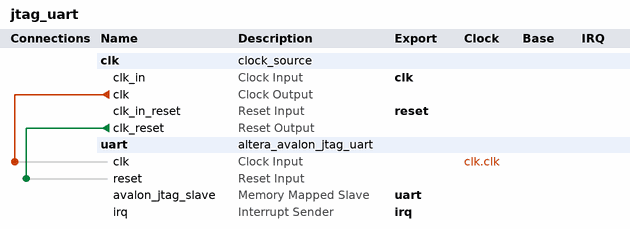
[diagram p0: system contents]
# Platform Designer (Qsys) system jtag_uart, MAX 10 10M50DAF484C7G
# Parameters at their usual value, and those the tool derives, are not listed.
package require -exact qsys 18.1
create_system jtag_uart
set_project_property DEVICE_FAMILY {MAX 10}
set_project_property DEVICE 10M50DAF484C7G

add_instance clk clock_source 18.1
set_instance_parameter_value clk clockFrequency 50000000

add_instance uart altera_avalon_jtag_uart 18.1
set_instance_parameter_value uart simInteractiveOptions NO_INTERACTIVE_WINDOWS

# connections
add_connection clk.clk uart.clk clock
add_connection clk.clk_reset uart.reset reset

# exported interfaces
add_interface clk clock sink
set_interface_property clk EXPORT_OF clk.clk_in
add_interface irq interrupt sender
set_interface_property irq EXPORT_OF uart.irq
add_interface reset reset sink
set_interface_property reset EXPORT_OF clk.clk_in_reset
add_interface uart avalon slave
set_interface_property uart EXPORT_OF uart.avalon_jtag_slave

set_interconnect_requirement {$system} qsys_mm.clockCrossingAdapter HANDSHAKE
set_interconnect_requirement {$system} qsys_mm.enableEccProtection FALSE
set_interconnect_requirement {$system} qsys_mm.insertDefaultSlave FALSE
set_interconnect_requirement {$system} qsys_mm.maxAdditionalLatency 1

save_system jtag_uart.qsys
